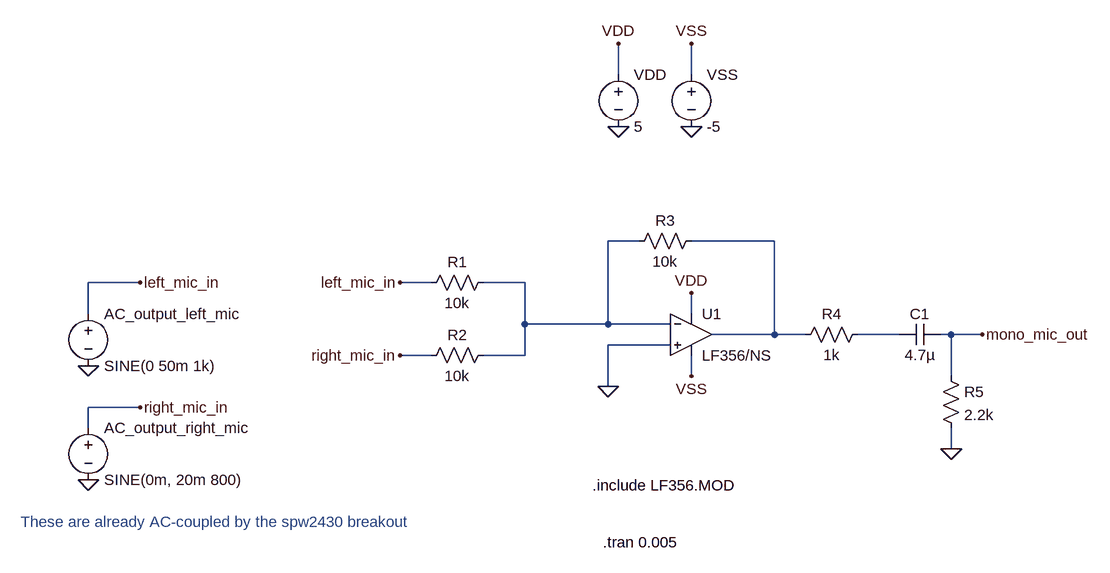
[diagram p0: schematic mic_stereo_to_mono_draft1.asc]
mic_stereo_to_mono_draft1.asc, the LTspice schematic file:
Version 4
SHEET 1 1900 680
WIRE 624 -128 624 -176
WIRE 736 -128 736 -176
WIRE 656 128 608 128
WIRE 864 128 736 128
WIRE -112 192 -192 192
WIRE 336 192 288 192
WIRE 480 192 416 192
WIRE -192 240 -192 192
WIRE 736 240 736 208
WIRE 480 256 480 192
WIRE 608 256 608 128
WIRE 608 256 480 256
WIRE 704 256 608 256
WIRE 864 272 864 128
WIRE 864 272 768 272
WIRE 912 272 864 272
WIRE 1056 272 992 272
WIRE 1136 272 1120 272
WIRE 1184 272 1136 272
WIRE 704 288 608 288
WIRE 336 304 288 304
WIRE 480 304 480 256
WIRE 480 304 416 304
WIRE 736 336 736 304
WIRE 1136 336 1136 272
WIRE 608 352 608 288
WIRE -112 384 -192 384
WIRE -192 416 -192 384
WIRE 1136 448 1136 416
FLAG -192 320 0
FLAG -192 496 0
FLAG -112 192 left_mic_in
FLAG -112 384 right_mic_in
FLAG 288 192 left_mic_in
FLAG 288 304 right_mic_in
FLAG 608 352 0
FLAG 1184 272 mono_mic_out
FLAG 1136 448 0
FLAG 624 -48 0
FLAG 736 -48 0
FLAG 624 -176 VDD
FLAG 736 -176 VSS
FLAG 736 208 VDD
FLAG 736 336 VSS
SYMBOL OpAmps/opamp2 736 208 R0
SYMATTR InstName U1
SYMATTR Value LF356/NS
SYMBOL Voltage -192 224 R0
SYMATTR InstName AC_output_left_mic
SYMATTR Value SINE(0 50m 1k)
SYMBOL Voltage -192 400 R0
SYMATTR InstName AC_output_right_mic
SYMATTR Value SINE(0m, 20m 800)
SYMBOL Res 432 176 R90
WINDOW 0 0 56 VBottom 2
WINDOW 3 32 56 VTop 2
SYMATTR InstName R1
SYMATTR Value 10k
SYMBOL Res 432 288 R90
WINDOW 0 0 56 VBottom 2
WINDOW 3 32 56 VTop 2
SYMATTR InstName R2
SYMATTR Value 10k
SYMBOL Res 752 112 R90
WINDOW 0 0 56 VBottom 2
WINDOW 3 32 56 VTop 2
SYMATTR InstName R3
SYMATTR Value 10k
SYMBOL Res 1008 256 R90
WINDOW 0 0 56 VBottom 2
WINDOW 3 32 56 VTop 2
SYMATTR InstName R4
SYMATTR Value 1k
SYMBOL Cap 1120 256 R90
WINDOW 0 0 32 VBottom 2
WINDOW 3 32 32 VTop 2
SYMATTR InstName C1
SYMATTR Value 4.7µ
SYMBOL Res 1120 320 R0
SYMATTR InstName R5
SYMATTR Value 2.2k
SYMBOL Voltage 624 -144 R0
SYMATTR InstName VDD
SYMATTR Value 5
SYMBOL Voltage 736 -144 R0
SYMATTR InstName VSS
SYMATTR Value -5
TEXT -296 560 Left 2 ;These are already AC-coupled by the spw2430 breakout
TEXT 584 504 Left 2 !.include LF356.MOD
TEXT 600 592 Left 2 !.tran 0.005

The netlist it stands for:
* mic_stereo_to_mono_draft1.asc
XU1 0 N001 VDD VSS N002 LF356/NS  ; pins In+ In- V+ V- OUT
V§AC_output_left_mic left_mic_in 0 SINE(0 50m 1k)
V§AC_output_right_mic right_mic_in 0 SINE(0m, 20m 800)
R1 N001 left_mic_in 10k
R2 N001 right_mic_in 10k
R3 N002 N001 10k
R4 N003 N002 1k
C1 mono_mic_out N003 4.7µ
R5 mono_mic_out 0 2.2k
VDD VDD 0 5
VSS VSS 0 -5
* These are already AC-coupled by the spw2430 breakout
.include LF356.MOD
.tran 0.005
.backanno
.end